# EAGLE design bluefet32 (EAGLE 5.06)
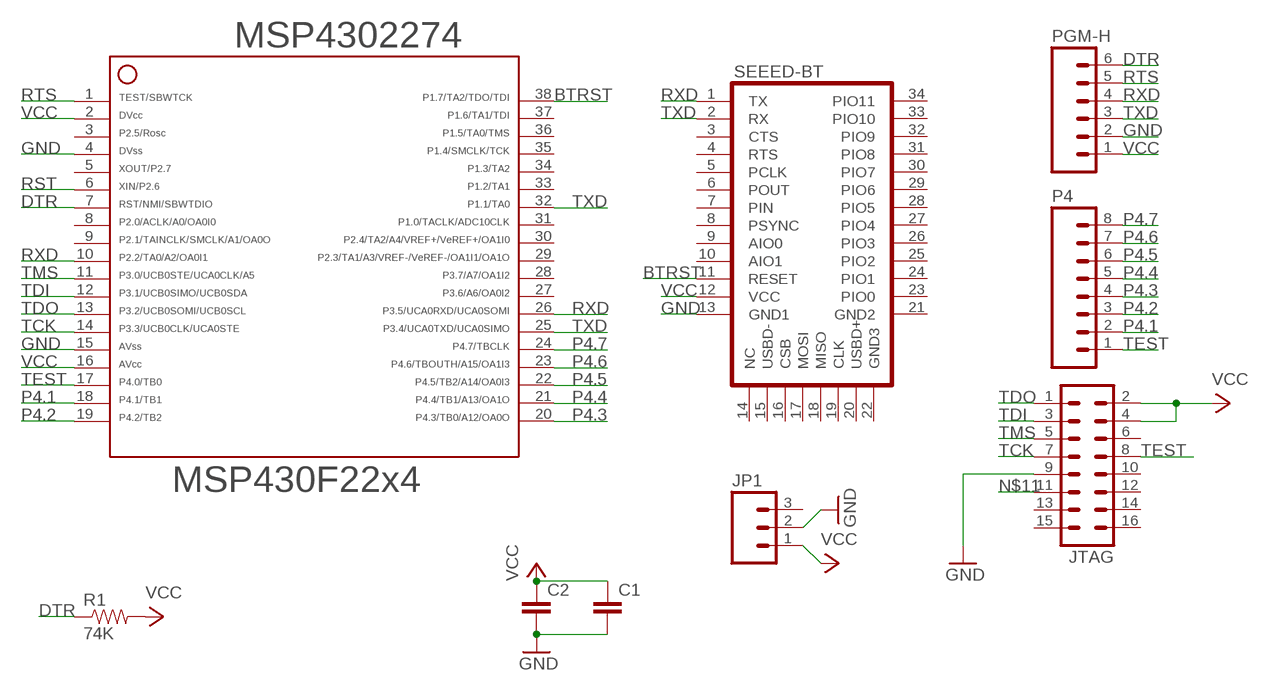
[diagram p0: schematic, sheet 1]

## Parts
C1  CAP0603-CAP  [0603-CAP]
C2  CAP0603-CAP  [0603-CAP]
JP1  M03PTH  [1X03]
JTAG  MA08-2  [MA08-2]
MSP4302274  F22X4---DA38  [DA38]
P4  M08LONGPADS  [1X08_LONGPADS]
PGM-H  M06SIP  [1X06]
R1  74K  RESISTOR0603-RES  [0603-RES]
SEEED-BT  SEEED-BTMASTER/SLAVE  [SEEED-BT]

## Nets
BTRST: MSP4302274.38 SEEED-BT.11(RESET)
DTR: MSP4302274.7 PGM-H.6 R1.1
GND: C1.2 C2.2 JP1.2 JTAG.9 MSP4302274.4 MSP4302274.15 PGM-H.2 SEEED-BT.13(GND1)
N$11: JTAG.11
P4.1: MSP4302274.18 P4.2
P4.2: MSP4302274.19 P4.3
P4.3: MSP4302274.20 P4.4
P4.4: MSP4302274.21 P4.5
P4.5: MSP4302274.22 P4.6
P4.6: MSP4302274.23 P4.7
P4.7: MSP4302274.24 P4.8
RST: MSP4302274.6
RTS: MSP4302274.1 PGM-H.5
RXD: MSP4302274.10 MSP4302274.26 PGM-H.4 SEEED-BT.1(TX)
TCK: JTAG.7 MSP4302274.14
TDI: JTAG.3 MSP4302274.12
TDO: JTAG.1 MSP4302274.13
TEST: JTAG.8 MSP4302274.17 P4.1
TMS: JTAG.5 MSP4302274.11
TXD: MSP4302274.25 MSP4302274.32 PGM-H.3 SEEED-BT.2(RX)
VCC: C1.1 C2.1 JP1.1 JTAG.2 JTAG.4 MSP4302274.2 MSP4302274.16 PGM-H.1 R1.2 SEEED-BT.12(VCC)
Unconnected: JP1.3 JTAG.6 JTAG.10 JTAG.12 JTAG.13 JTAG.14 JTAG.15 JTAG.16 MSP4302274.3 MSP4302274.5 MSP4302274.8 MSP4302274.9 MSP4302274.27 MSP4302274.28 MSP4302274.29 MSP4302274.30 MSP4302274.31 MSP4302274.33 MSP4302274.34 MSP4302274.35 MSP4302274.36 MSP4302274.37 SEEED-BT.3(CTS) SEEED-BT.4(RTS) SEEED-BT.5(PCLK) SEEED-BT.6(POUT) SEEED-BT.7(PIN) SEEED-BT.8(PSYNC) SEEED-BT.9(AIO0) SEEED-BT.10(AIO1) SEEED-BT.14(NC) SEEED-BT.15(USBD-) SEEED-BT.16(CSB) SEEED-BT.17(MOSI) SEEED-BT.18(MISO) SEEED-BT.19(CLK) SEEED-BT.20(USBD+) SEEED-BT.21(GND2) SEEED-BT.22(GND3) SEEED-BT.23(PIO0) SEEED-BT.24(PIO1) SEEED-BT.25(PIO2) SEEED-BT.26(PIO3) SEEED-BT.27(PIO4) SEEED-BT.28(PIO5) SEEED-BT.29(PIO6) SEEED-BT.30(PIO7) SEEED-BT.31(PIO8) SEEED-BT.32(PIO9) SEEED-BT.33(PIO10) SEEED-BT.34(PIO11)

## Library data of the parts
C1 C2 = SparkFun:CAP: Capacitor Standard 0603 ceramic capacitor, and 0.1" leaded capacitor.
JP1 = SparkFun:M03: Header 3 Standard 3-pin 0.1" header. Use with straight break away headers (SKU : PRT-00116), right angle break away headers (PRT-00553), swiss pins (PRT-00743), machine pins (PRT-00117), and female headers (PRT-00115). Molex polarized connector foot print use with SKU : PRT-08232 with associated crimp pins and housings.
JTAG = con-lstb:MA08-2: PIN HEADER
MSP4302274 = TI_MSP430_v13:F22X4---DA38: ***MSP430F22x4***DA38
P4 = SparkFun:M08: Header 8 Standard 8-pin 0.1" header. Use with straight break away headers (SKU : PRT-00116), right angle break away headers (PRT-00553), swiss pins (PRT-00743), machine pins (PRT-00117), and female headers (PRT-00115).
PGM-H = SparkFun:M06: Header 6 Standard 6-pin 0.1" header. Use with straight break away headers (SKU : PRT-00116), right angle break away headers (PRT-00553), swiss pins (PRT-00743), machine pins (PRT-00117), and female headers (PRT-00115). Molex polarized connector foot print use with SKU : PRT-08094 with associated crimp pins and housings. NOTES ON THE VARIANTS LOCK and LOCK_LONGPADS... This footprint was designed to help hold the alignment of a through-hole component (i.e. 6-pin header) while soldering it into place. You may notice that each hole has been shifted either up or down by 0.005 of an inch from it's more standard position (which is a perfectly straight line). This slight alteration caused the pins (the squares in the middle) to touch the edges of the holes. Because they are alternating, it causes a "brace" to hold the component in place. 0.005 has proven to be the perfect amount of "off-center" position when using our standard breakaway headers. Although looks a little odd when you look at the bare footprint, once you have a header in there, the alteration is very hard to notice. Also, if you push a header all the way into place, it is covered up entirely on the bottom side. This idea of altering the position of holes to aid alignment will be further integrated into the Sparkfun Library for other footprints. It can help hold any component with 3 or more connection pins.
R1 = SparkFun:RESISTOR: Resistor Basic schematic elements and footprints for 0603, 1206, and PTH 1/10th watt (small) resistors.
SEEED-BT = dragorn:SEEED-BT: SEEED Bluetooth Master/Slave RFCOMM Module

## Board
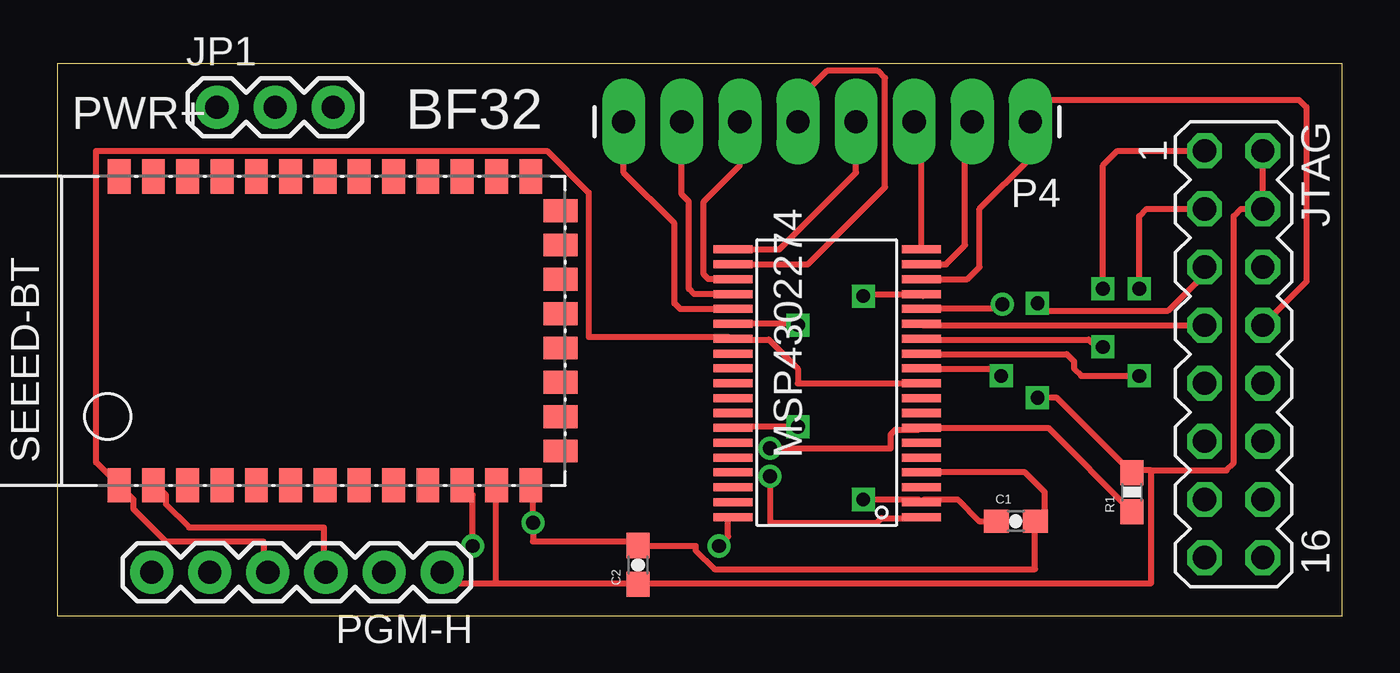
[diagram p1: board, top side]
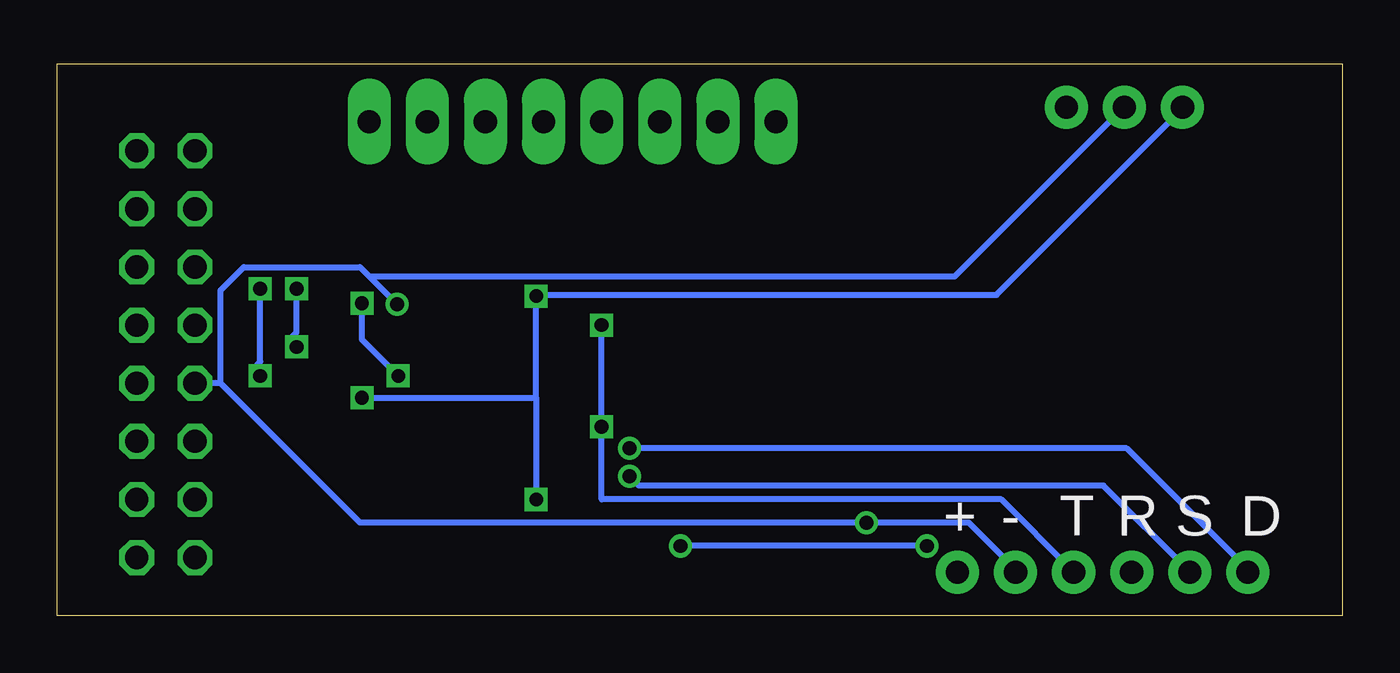
[diagram p2: board, bottom side, seen from below]

Size 56.18 x 24.12 mm. Coordinates in mm from the lower left corner, seen from the top.
Outline: 0,0 56.18,0 56.18,24.12 0,24.12 0,0
Copper layers (1*16): Top 0.035mm / dielectric 1.5mm / Bottom 0.035mm
Design rules "default": minimum track width 10mil, minimum drill 24mil, track to track 8mil, track to pad 8mil, pad to pad 8mil, via to via 8mil, smd to smd 8mil, copper to edge 40mil, drill to drill 8mil, minimum pad ring 10mil, minimum via ring 8mil, stop-mask expansion 4mil, vias tented up to drill 0mil, thermal gap 10mil

### Footprints (pad centres in the part's own frame; a part is rotated, then mirrored left to right if it is on the bottom)
0603-CAP = smd 1.1 x 1: 1 -0.85,0; 2 0.85,0
1X03 = drill 1.016 pad 1.88 round: 1 0,0; 2 2.54,0; 3 5.08,0
MA08-2 = drill 1.016 octagon: 1 -8.89,-1.27; 2 -8.89,1.27; 3 -6.35,-1.27; 4 -6.35,1.27; 5 -3.81,-1.27; 6 -3.81,1.27; 7 -1.27,-1.27; 8 -1.27,1.27; 9 1.27,-1.27; 10 1.27,1.27; 11 3.81,-1.27; 12 3.81,1.27; 13 6.35,-1.27; 14 6.35,1.27; 15 8.89,-1.27; 16 8.89,1.27
DA38 = smd 0.35 x 1.705: 1 -5.85,-4.12; 2 -5.2,-4.12; 3 -4.55,-4.12; 4 -3.9,-4.12; 5 -3.25,-4.12; 6 -2.6,-4.12; 7 -1.95,-4.12; 8 -1.3,-4.12; 9 -0.65,-4.12; 10 0,-4.12; 11 0.65,-4.12; 12 1.3,-4.12; 13 1.95,-4.12; 14 2.6,-4.12; 15 3.25,-4.12; 16 3.9,-4.12; 17 4.55,-4.12; 18 5.2,-4.12; 19 5.85,-4.12; 20 5.85,4.12; 21 5.2,4.12; 22 4.55,4.12; 23 3.9,4.12; 24 3.25,4.12; 25 2.6,4.12; 26 1.95,4.12; 27 1.3,4.12; 28 0.65,4.12; 29 0,4.12; 30 -0.65,4.12; 31 -1.3,4.12; 32 -1.95,4.12; 33 -2.6,4.12; 34 -3.25,4.12; 35 -3.9,4.12; 36 -4.55,4.12; 37 -5.2,4.12; 38 -5.85,4.12
1X08_LONGPADS = drill 1.016 pad 1.88 long: 1 0,0; 2 2.54,0; 3 5.08,0; 4 7.62,0; 5 10.16,0; 6 12.7,0; 7 15.24,0; 8 17.78,0
1X06 = drill 1.016 pad 1.88 round: 1 0,0; 2 2.54,0; 3 5.08,0; 4 7.62,0; 5 10.16,0; 6 12.7,0
0603-RES = smd 1.1 x 1: 1 -0.85,0; 2 0.85,0
SEEED-BT = smd 1.5 x 1: 1 -7,6.5; 2 -7,5; 3 -7,3.5; 4 -7,2; 5 -7,0.5; 6 -7,-1; 7 -7,-2.5; 8 -7,-4; 9 -7,-5.5; 10 -7,-7; 11 -7,-8.5; 12 -7,-10; 13 -7,-11.5; 22 6.5,-11.5; 23 6.5,-10; 24 6.5,-8.5; 25 6.5,-7; 26 6.5,-5.5; 27 6.5,-4; 28 6.5,-2.5; 29 6.5,-1; 30 6.5,0.5; 31 6.5,2; 32 6.5,3.5; 33 6.5,5; 34 6.5,6.5 | smd 1 x 1.5: 14 -5.5,-12.8; 15 -4,-12.8; 16 -2.5,-12.8; 17 -1,-12.8; 18 0.5,-12.8; 19 2,-12.8; 20 3.5,-12.8; 21 5,-12.8

### Placement (x,y rotation side)
C1  41.91,4.13 0 top
C2  25.4,2.22 90 top
JP1  6.98,22.23 0 top
JTAG  51.43,11.43 270 top
MSP4302274  33.66,10.16 90 top
P4  42.55,21.59 180 top
PGM-H  16.83,1.9 180 top
R1  46.99,5.4 90 top
SEEED-BT  9.21,12.7 90 top

### Tracks (layer width: path | path; a pad name or v marks a point on that pad's centre or on a via)
BTRST  (via drill 0.61)
  Top 0.254: v18.16,3.05 18.16,5.28 17.75,5.69 SEEED-BT.11 | v28.93,3.05 29.34,3.45 29.34,4.27 MSP4302274.38
  Bottom 0.254: v18.16,3.05 v28.93,3.05
DTR  (via drill 0.61)
  Top 0.254: MSP4302274.7 37.82,8.26 | R1.1 43.33,8.21 MSP4302274.7 | v31.17,7.31 36.45,7.31 36.45,7.92 36.65,8.13 37.67,8.13 MSP4302274.7
  Bottom 0.254: v31.17,7.31 9.42,7.31 4.14,2.03 PGM-H.6
GND  (via drill 0.61)
  Top 0.254: MSP4302274.4 42.32,6.26 43.18,5.4 43.18,4.55 C1.2 42.75,4.06 42.75,2.03 28.73,2.03 27.91,2.84 27.91,3.05 25.48,3.05 C2.2 25.27,3.25 20.8,3.25 v20.8,4.06 20.8,5.69 SEEED-BT.13 | v41.33,13.61 41.33,13.41 37.87,13.41 MSP4302274.15
  Bottom 0.254: PGM-H.2 14.3,2.03 16.33,4.06 v20.8,4.06 42.95,4.06 49.05,10.16 | 42.55,14.83 42.95,15.24 48.03,15.24 49.05,14.22 49.05,10.16 | 42.55,14.83 v41.33,13.61 | 49.05,10.16 JTAG.9 | 42.55,14.83 16.94,14.83 9.63,22.15 JP1.2
P4.1
  Top 0.254: P4.2 39.69,21.27 39.69,16.19 38.85,15.36 MSP4302274.18
P4.2
  Top 0.254: P4.3 37.77,21.28 MSP4302274.19
P4.3
  Top 0.254: P4.4 34.92,19.37 31.57,16.01 MSP4302274.20
P4.4
  Top 0.254: P4.5 32.38,22.54 33.66,23.81 35.88,23.81 36.2,23.49 36.2,18.73 32.82,15.36 MSP4302274.21
P4.5
  Top 0.254: P4.6 29.84,19.68 28.26,18.1 28.26,14.92 28.47,14.71 MSP4302274.22
P4.6
  Top 0.254: P4.7 27.3,18.41 27.62,18.1 27.62,14.29 27.85,14.06 MSP4302274.23
P4.7
  Top 0.254: P4.8 24.77,19.37 26.99,17.15 26.99,13.65 27.23,13.41 MSP4302274.24
RTS  (via drill 0.61)
  Top 0.254: v31.17,6.1 31.17,4.06 35.84,4.06 36.04,4.27 37.67,4.27 MSP4302274.1
  Bottom 0.254: v31.17,6.1 30.76,5.69 10.44,5.69 6.78,2.03 PGM-H.5
RXD
  Top 0.254: MSP4302274.10 32.38,10.16 32.38,10.79 31.12,12.06 29.58,12.06 MSP4302274.26 29.34,12.19 23.24,12.19 23.24,18.49 21.41,20.32 1.7,20.32 1.7,6.71 2.51,5.89 SEEED-BT.1 2.72,5.69 3.33,5.08 3.33,4.67 4.75,3.25 9.02,3.25 9.02,2.03 PGM-H.4
TCK
  Top 0.254: MSP4302274.14 37.84,12.7 JTAG.7
TDI  (via drill 0.6)
  Top 0.254: MSP4302274.12 37.8,11.43 44.13,11.43 44.45,11.11 44.45,10.79 44.77,10.48 v47.31,10.48 | v47.31,14.29 47.31,17.46 47.62,17.78 JTAG.3
  Bottom 0.254: v47.31,10.48 47.62,10.79 47.31,11.11 v47.31,14.29
TDO  (via drill 0.6)
  Top 0.254: MSP4302274.13 37.82,12.06 45.09,12.06 45.4,11.75 v45.72,11.75 | v45.72,14.29 45.72,19.68 46.35,20.32 JTAG.1
  Bottom 0.254: v45.72,11.75 46.04,12.06 45.72,12.38 v45.72,14.29
TEST
  Top 0.254: MSP4302274.17 39.79,14.71 40.32,15.24 40.32,17.78 42.55,20 P4.1 42.55,22.23 42.86,22.54 54.29,22.54 54.61,22.23 54.61,14.6 JTAG.8
TMS  (via drill 0.6)
  Top 0.254: MSP4302274.11 37.79,10.79 40.96,10.79 v41.27,10.48 | v42.86,13.65 43.18,13.34 48.58,13.34 50.16,14.92 JTAG.5
  Bottom 0.254: v41.27,10.48 42.86,12.06 v42.86,13.65
TXD  (via drill 0.6)
  Top 0.254: MSP4302274.25 32.32,12.76 v32.38,12.7 | v32.38,8.26 29.58,8.26 MSP4302274.32 | SEEED-BT.2 4.34,5.69 4.75,5.28 4.75,4.88 5.77,3.86 11.66,3.86 11.66,2.03 PGM-H.3
  Bottom 0.254: v32.38,12.7 v32.38,8.26 32.38,5.08 14.91,5.08 11.86,2.03 PGM-H.3
VCC  (via drill 0.6)
  Top 0.254: v35.24,5.08 37.66,5.08 MSP4302274.2 37.89,5.08 39.37,5.08 40.32,4.13 C1.1 | v35.24,13.97 35.33,14.06 MSP4302274.16 37.87,13.97 | 47.83,6.35 47.09,6.35 R1.2 43.71,9.52 v42.86,9.52 | 47.83,6.35 51.12,6.35 51.43,6.67 51.43,17.46 51.75,17.78 JTAG.4 JTAG.2 | 19.18,1.42 16.94,1.42 16.94,1.83 PGM-H.1 | 19.18,1.42 25.27,1.42 C2.1 25.48,1.42 47.83,1.42 47.83,6.35 | 19.18,1.42 19.18,5.69 SEEED-BT.12
  Bottom 0.254: 35.24,9.52 v35.24,5.08 | 35.24,9.52 v35.24,13.97 35.23,14.02 15.11,14.02 6.98,22.15 JP1.1 | v42.86,9.52 35.24,9.52

### Text on the board
tPlace: PWR+ | BF32
bPlace: D | S | R | T | - | +